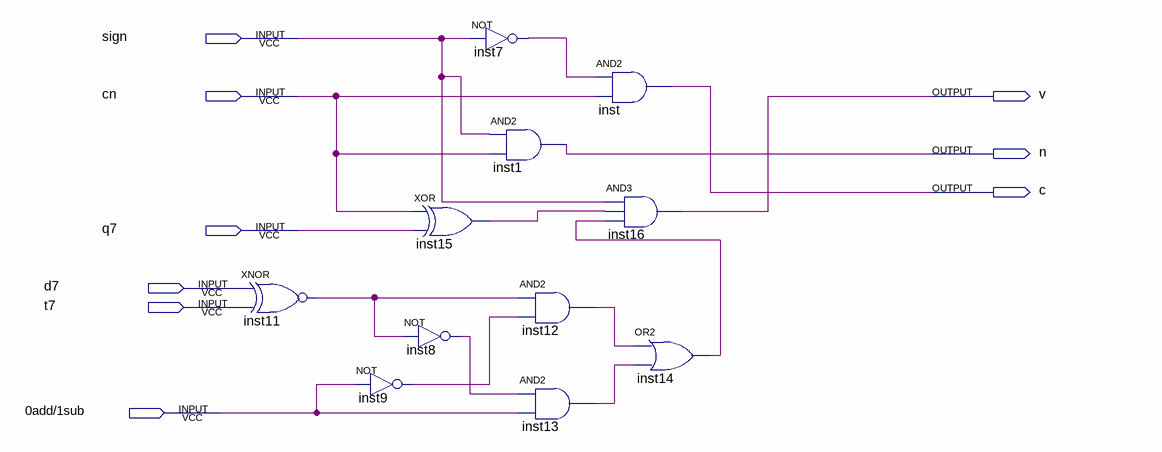
[diagram p0: schematic sheet]
// Quartus schematic sign.bdf as structural Verilog: 11 symbols, 9 pins
module sign (
  input  sign,
  input  cn,
  input  q7,
  input  d7,
  input  t7,
  input  \0add/1sub ,
  output v,
  output n,
  output c
);

  wire inst7_out, inst8_out, inst9_out, inst11_out, inst12_out, inst13_out, inst14_out, inst15_out;

  xnor inst11 (inst11_out, d7, t7);
  not inst9 (inst9_out, \0add/1sub );
  not inst7 (inst7_out, sign);
  xor inst15 (inst15_out, cn, q7);
  not inst8 (inst8_out, inst11_out);
  and inst1 (n, sign, cn);
  and inst12 (inst12_out, inst11_out, inst9_out);
  and inst13 (inst13_out, inst8_out, \0add/1sub );
  and inst (c, inst7_out, cn);
  and inst16 (v, sign, inst15_out, inst14_out);
  or inst14 (inst14_out, inst12_out, inst13_out);
endmodule
